# Altium schematic sheet TTP224.SchDoc
size A4; SheetNumber: 1; SheetTotal: 2
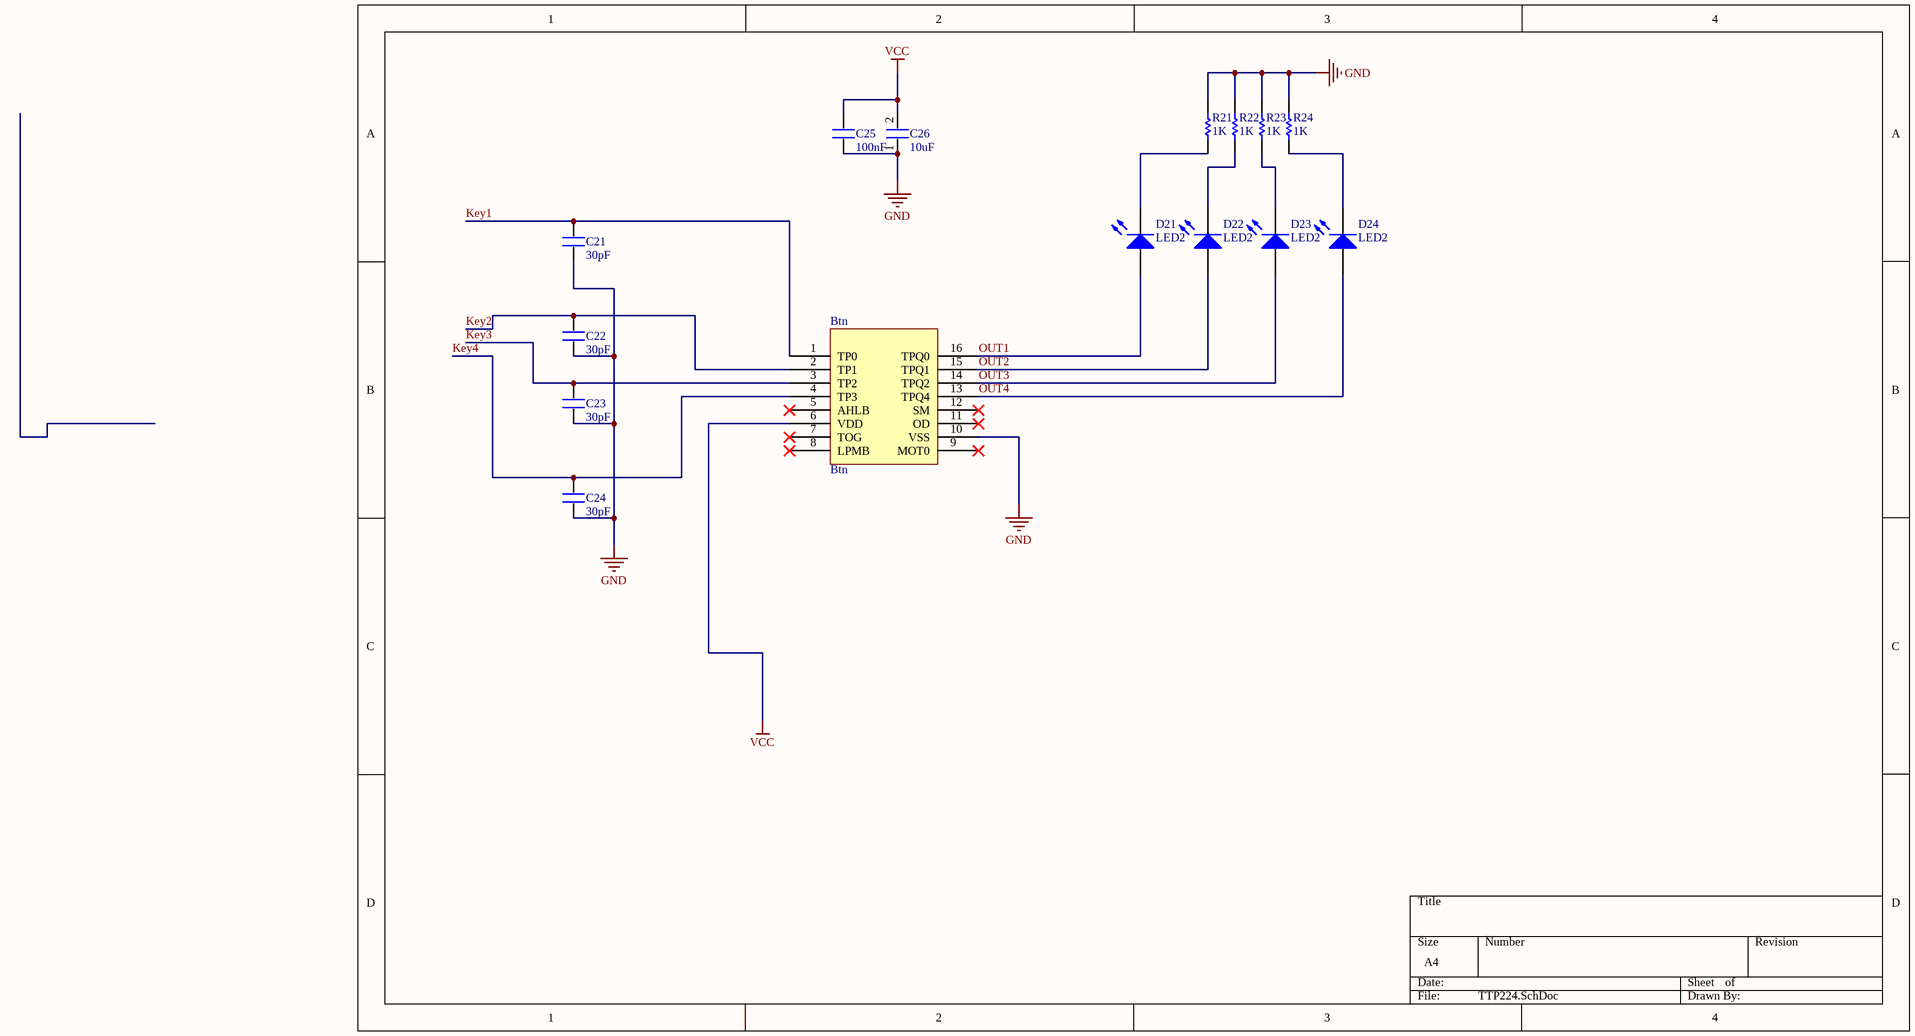
[diagram p0: TTP224.SchDoc]

## Parts
Btn  Btn  [SOP64P600X175-16N]
C21  value 30pF  [0805]  (hidden comment: CAP)
C22  value 30pF  [0805]  (hidden comment: CAP)
C23  value 30pF  [0805]  (hidden comment: CAP)
C24  value 30pF  [0805]  (hidden comment: CAP)
C25  value 100nF  [0805]  (hidden comment: CAP)
C26  value 10uF  [0805]  (hidden comment: CAP)
D21  LED2  [3.2X1.6X1.1]
D22  LED2  [3.2X1.6X1.1]
D23  LED2  [3.2X1.6X1.1]
D24  LED2  [3.2X1.6X1.1]
R21  Vaule: 1K  [0805]  (hidden comment: RES)
R22  Vaule: 1K  [0805]  (hidden comment: RES)
R23  Vaule: 1K  [0805]  (hidden comment: RES)
R24  Vaule: 1K  [0805]  (hidden comment: RES)

## Nets
GND: Btn.10(VSS) C21.1 C22.1 C23.1 C24.1 C25.1 C26.1 R21.2 R22.2 R23.2 R24.2
VCC: Btn.6(VDD) C25.2 C26.2
Key1: Btn.1(TP0) C21.2
Key2: Btn.2(TP1) C22.2
Key3: Btn.3(TP2) C23.2
Key4: Btn.4(TP3) C24.2
OUT1: Btn.16(TPQ0) D21.1(A)
OUT2: Btn.15(TPQ1) D22.1(A)
OUT3: Btn.14(TPQ2) D23.1(A)
OUT4: Btn.13(TPQ4) D24.1(A)
NetD21_2: D21.2(K) R21.1
NetD22_2: D22.2(K) R22.1
NetD23_2: D23.2(K) R23.1
NetD24_2: D24.2(K) R24.1

Not connected (* = marked no-connect by the designer): Btn 5(AHLB)* 7(TOG)* 8(LPMB)* 9(MOT0)* 11(OD)* 12(SM)*

## Library data of the parts
C21-C26 = CAP: Capacitor
D21-D24 = LED2: Typical RED, GREEN, YELLOW, AMBER GaAs LED; Published: 8-Jun-2000; LatestRevisionDate: 17-Jul-2002; LatestRevisionNote: Re-released for DXP Platform.; PackageVersion: Feb-2002; PackageReference: 3.2X1.6X1.1; Publisher: Altium Limited; PackageDescription: SM LED; 2 Flat Leads
R21-R24 = RES: Resistor